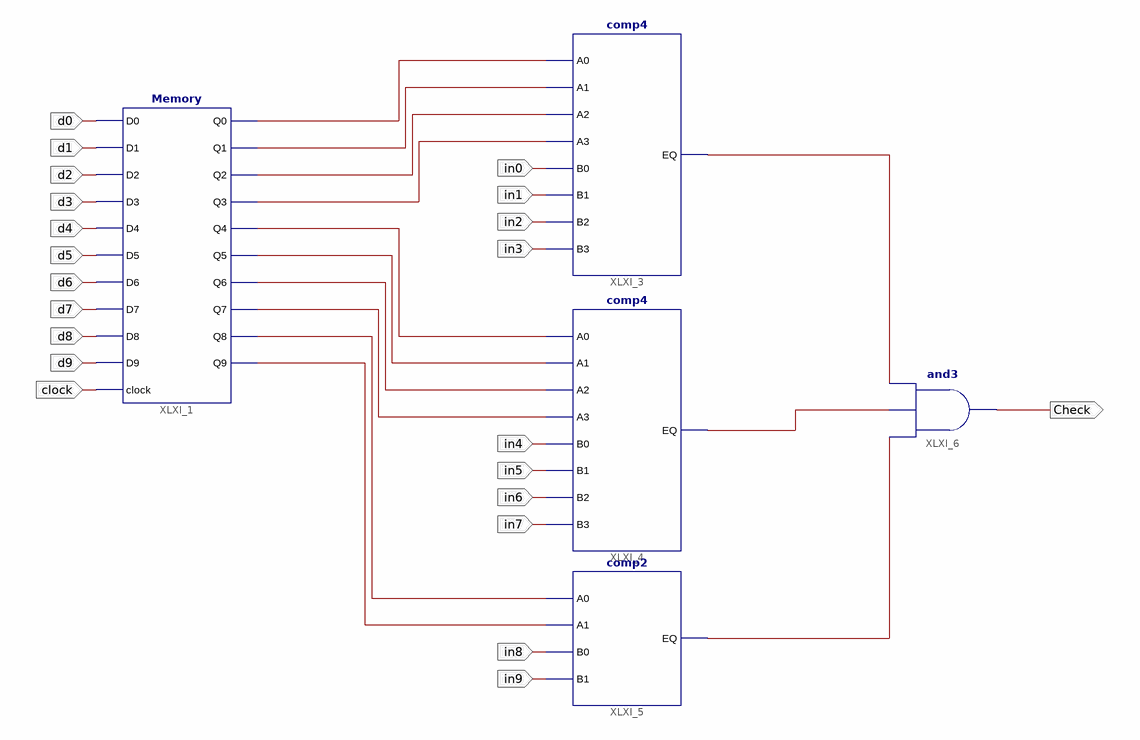
[diagram p0: schematic sheet 1]
// Xilinx ISE schematic Check_Pass.sch (xc9500xl) as structural Verilog: 5 symbols, 22 ports
module Check_Pass (
  input  d0,
  input  d1,
  input  d2,
  input  d3,
  input  d4,
  input  d5,
  input  d6,
  input  d7,
  input  d8,
  input  d9,
  input  clock,
  input  in0,
  input  in1,
  input  in2,
  input  in3,
  input  in4,
  input  in5,
  input  in6,
  input  in7,
  input  in8,
  input  in9,
  output Check
);

  wire XLXN_1, XLXN_2, XLXN_3, XLXN_4, XLXN_5, XLXN_33, XLXN_34, XLXN_35, XLXN_39, XLXN_40, XLXN_41, XLXN_42,
       XLXN_43;

  Memory XLXI_1 (
    .clock(clock), .D0(d0), .D1(d1), .D2(d2), .D3(d3), .D4(d4), .D5(d5), .D6(d6), .D7(d7), .D8(d8), .D9(d9),
    .Q0(XLXN_1), .Q1(XLXN_2), .Q2(XLXN_3), .Q3(XLXN_4), .Q4(XLXN_5), .Q5(XLXN_39), .Q6(XLXN_40),
    .Q7(XLXN_41), .Q8(XLXN_42), .Q9(XLXN_43));
  comp4 XLXI_3 (
    .A0(XLXN_1), .A1(XLXN_2), .A2(XLXN_3), .A3(XLXN_4), .B0(in0), .B1(in1), .B2(in2), .B3(in3), .EQ(XLXN_33));
  comp4 XLXI_4 (
    .A0(XLXN_5), .A1(XLXN_39), .A2(XLXN_40), .A3(XLXN_41), .B0(in4), .B1(in5), .B2(in6), .B3(in7),
    .EQ(XLXN_34));
  comp2 XLXI_5 (.A0(XLXN_42), .A1(XLXN_43), .B0(in8), .B1(in9), .EQ(XLXN_35));
  and XLXI_6 (Check, XLXN_35, XLXN_34, XLXN_33);
endmodule
